# EAGLE design Solenoid Boardv2 (EAGLE 9.1.3)
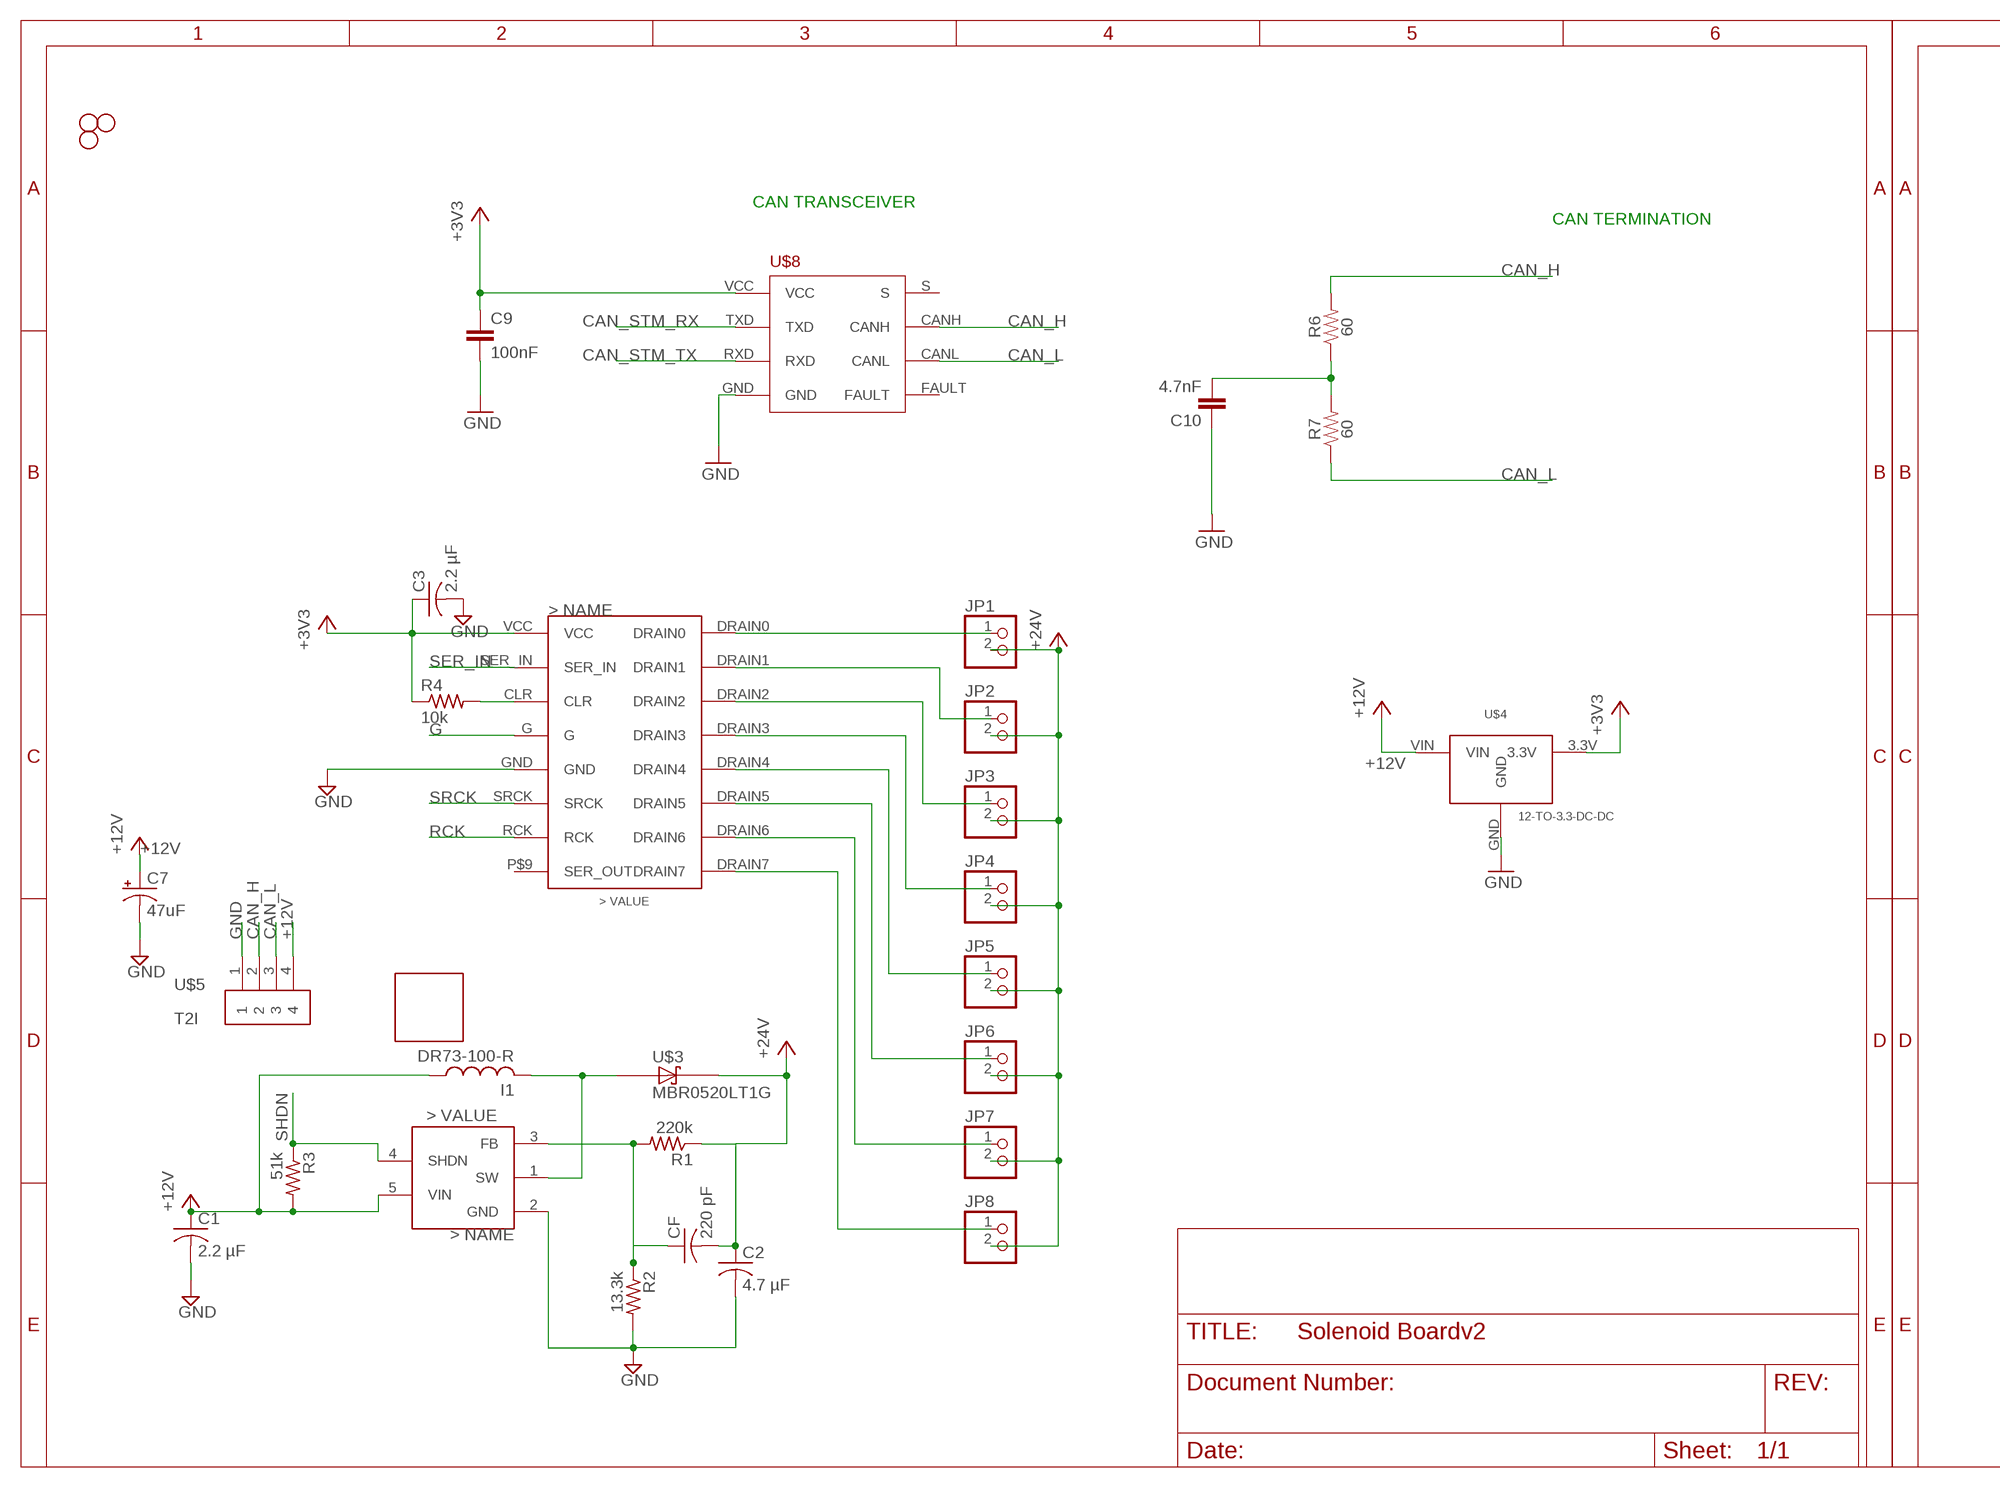
[diagram p0: schematic, sheet 1, part 1 of 2]
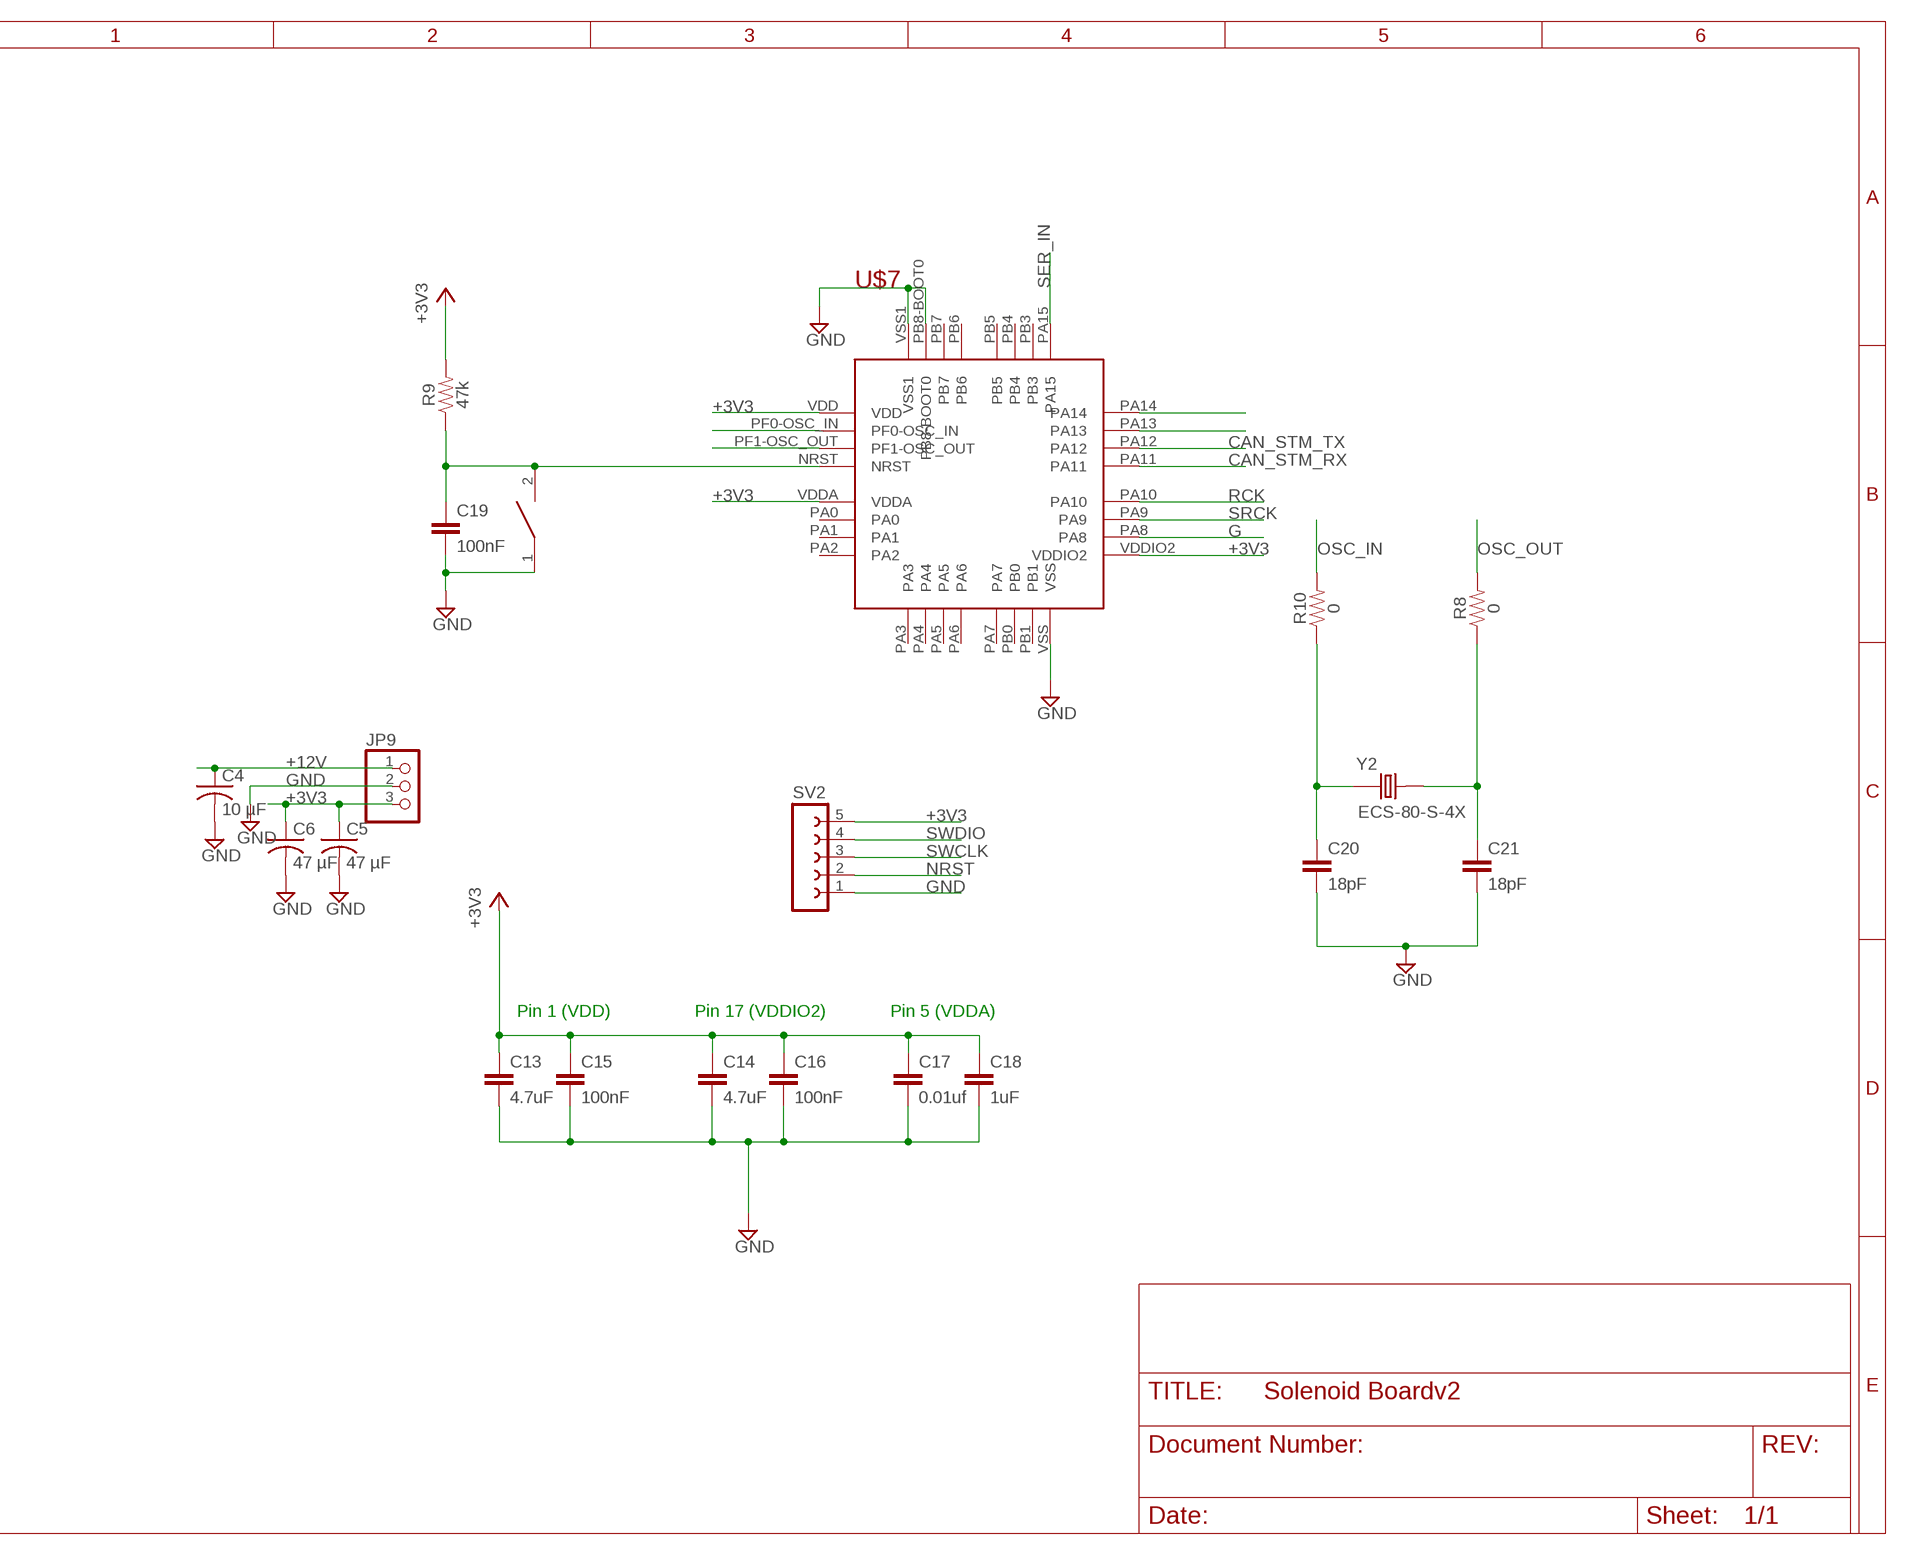
[diagram p1: schematic, sheet 1, part 2 of 2]

## Parts
C1  2.2 µF  C-USC0805  [C0805]
C2  4.7 µF  C-USC0805  [C0805]
C3  2.2 µF  C-USC0805  [C0805]
C4  10 µF  C-USC0805  [C0805]
C5  47 µF  C-USC0805  [C0805]
C6  47 µF  C-USC0805  [C0805]
C7  47uF  47UF-POLAR-PANASONIC_D-35V-20%  [PANASONIC_D]
C9  100nF  4.7UF0603  [0603]
C10  4.7nF  0.1UF-0603-25V-(+80/-20%)  [0603]
C13  4.7uF  4.7UF0603  [0603]
C14  4.7uF  4.7UF0603  [0603]
C15  100nF  4.7UF0603  [0603]
C16  100nF  4.7UF0603  [0603]
C17  0.01uf  4.7UF0603  [0603]
C18  1uF  4.7UF0603  [0603]
C19  100nF  4.7UF0603  [0603]
C20  18pF  4.7UF0603  [0603]
C21  18pF  4.7UF0603  [0603]
CF  220 pF  C-USC0805  [C0805]
H1  STAND-OFF  [STAND-OFF]
H2  STAND-OFF  [STAND-OFF]
H3  STAND-OFF  [STAND-OFF]
I1  DR73-100-R  [DR73-100-R]
JP1  PINHD-1X2  [1X02]
JP2  PINHD-1X2  [1X02]
JP3  PINHD-1X2  [1X02]
JP4  PINHD-1X2  [1X02]
JP5  PINHD-1X2  [1X02]
JP6  PINHD-1X2  [1X02]
JP7  PINHD-1X2  [1X02]
JP8  PINHD-1X2  [1X02]
JP9  PINHD-1X3  [1X03]
R1  220k  R-US_R0603  [R0603]
R2  13.3k  R-US_R0603  [R0603]
R3  51k  R-US_R0603  [R0603]
R4  10k  R-US_R0603  [R0603]
R6  60  1KOHM-0603-1/10W-1%  [0603]
R7  60  1KOHM-0603-1/10W-1%  [0603]
R8  0  1KOHM-0603-1/10W-1%  [0603]
R9  47k  1KOHM-0603-1/10W-1%  [0603]
R10  0  1KOHM-0603-1/10W-1%  [0603]
RESET1  SWITCH  [SW_2512]
SV2  FE05-1  [FE05-1]
U$1  SHIFT_REGISTER  [SHIFT_REGISTER]
U$2  LM27313  [SOT95P300X145-5]
U$3  MBR0520LT1G  [SOD3716X135]
U$4  12-TO-3.3-DC-DC  [MURATA-DCDC]
U$5  T2I  [T2I]
U$6  BOARDPNE  [PNE]
U$7  STM32F042K6T6  [STM32F042K6T6]
U$8  TCAN337D  [TCAN337D]
Y2  ECS-80-S-4X  [XTAL_ECS-80-S-4X]

## Nets
+3V3: C3.1 C5.1 C6.1 C9.1 C13.1 C14.1 C15.1 C16.1 C17.1 C18.1 JP9.3 R4.1 R9.2 SV2.5 U$1.VCC U$4.3.3V U$7.VDD U$7.VDDA U$7.VDDIO2 U$8.VCC
+12V: C1.1 C4.1 C7.+ I1.1 JP9.1 R3.2 U$2.5(VIN) U$4.VIN U$5.4
+24V: C2.1 CF.2 JP1.2 JP2.2 JP3.2 JP4.2 JP5.2 JP6.2 JP7.2 JP8.2 R1.1 U$3.2(C)
CAN_H: R6.2 U$5.2 U$8.CANH
CAN_L: R7.1 U$5.3 U$8.CANL
CAN_STM_RX: U$7.PA11 U$8.TXD
CAN_STM_TX: U$7.PA12 U$8.RXD
CLR: R4.2 U$1.CLR
DRAIN0: JP1.1 U$1.DRAIN0
DRAIN1: JP2.1 U$1.DRAIN1
DRAIN2: JP3.1 U$1.DRAIN2
DRAIN3: JP4.1 U$1.DRAIN3
DRAIN4: JP5.1 U$1.DRAIN4
DRAIN5: JP6.1 U$1.DRAIN5
DRAIN6: JP7.1 U$1.DRAIN6
DRAIN7: JP8.1 U$1.DRAIN7
FB: CF.1 R1.2 R2.1 U$2.3(FB)
G: U$1.G U$7.PA8
GND: C1.2 C2.2 C3.2 C4.2 C5.2 C6.2 C7.- C9.2 C10.1 C13.2 C14.2 C15.2 C16.2 C17.2 C18.2 C19.2 C20.2 C21.2 JP9.2 R2.2 RESET1.1 SV2.1 U$1.GND U$2.2(GND) U$4.GND U$5.1 U$7.PB8-BOOT0 U$7.VSS U$7.VSS1 U$8.GND
N$3: C21.1 R8.1 Y2.2
N$4: C20.1 R10.1 Y2.1
N$5: C10.2 R6.1 R7.2
NRST: C19.1 R9.1 RESET1.2 SV2.2 U$7.NRST
OSC_IN: R10.2 U$7.PF0-OSC_IN
OSC_OUT: R8.2 U$7.PF1-OSC_OUT
RCK: U$1.RCK U$7.PA10
SER_IN: U$1.SER_IN U$7.PA15
SHDN: R3.1 U$2.4(SHDN)
SRCK: U$1.SRCK U$7.PA9
SW: I1.2 U$2.1(SW) U$3.1(A)
SWCLK: SV2.3 U$7.PA14
SWDIO: SV2.4 U$7.PA13
Unconnected: U$1.P$9(SER_OUT) U$7.PA0 U$7.PA1 U$7.PA2 U$7.PA3 U$7.PA4 U$7.PA5 U$7.PA6 U$7.PA7 U$7.PB0 U$7.PB1 U$7.PB3 U$7.PB4 U$7.PB5 U$7.PB6 U$7.PB7 U$8.FAULT U$8.S

## Notes on the sheet
- CAN TRANSCEIVER
- CAN TERMINATION
- Pin 1 (VDD) | Pin 17 (VDDIO2) | Pin 5 (VDDA)

## Library data of the parts
C1-C6 CF = rcl:C-US: CAPACITOR, American symbol; SPICEPREFIX: C
C7 = SparkFun-Capacitors:47UF-POLAR: 47µF polarized capacitors A capacitor is a passive two-terminal electrical component used to store electrical energy temporarily in an electric field.; PROD_ID: CAP-08478
C9 C15-C21 = SparkFun-Capacitors:4.7UF: 4.7µF ceramic capacitors A capacitor is a passive two-terminal electrical component used to store electrical energy temporarily in an electric field.; PROD_ID: CAP-08280; VALUE: 4.7uF
C10 = SparkFun-Capacitors:0.1UF: 0.1µF ceramic capacitors A capacitor is a passive two-terminal electrical component used to store electrical energy temporarily in an electric field.; PROD_ID: CAP-00810; VALUE: 0.1uF
C13 C14 = SparkFun-Capacitors:4.7UF: 4.7µF ceramic capacitors A capacitor is a passive two-terminal electrical component used to store electrical energy temporarily in an electric field.; PROD_ID: CAP-08280
H1-H3 = SparkFun-Hardware:STAND-OFF: Stand Off Drill holes for mechanically mounting via screws, standoffs, etc. Note: Use the keepout ring to avoid running the screw head into surrounding components. Variant Overviews STAND-OFF - Mechanical footprint for a #4 phillips button head screw. STAND-OFF-TIGHT - Mechanical footprint for a #4 phillips button head screw, Example SparkFun Products Screw - Phillips Head (1/4", 4-40, 10 pack) <https://www.sparkfun.com/products/10453> (PRT-10453) Screw - Phillips Head (1/2", 4-40, 10 pack) <https://www.sparkfun.com/products/10452> (PRT-10452) Screw - Phillips Head (3/4", 4-40, 10 pack) <https://www.sparkfun.com/products/10451> (PRT-10451) Screw - Phillips Head (1", 4-40, 10 pack) <https://www.sparkfun.com/products/10450> (PRT-10450)
I1 = Solenoid_parts:DR73-100-R
JP1-JP8 = pinhead:PINHD-1X2: PIN HEADER
JP9 = pinhead:PINHD-1X3: PIN HEADER
R1-R4 = rcl:R-US_: RESISTOR, American symbol; SPICEPREFIX: R
R6-R10 = SparkFun-Resistors:1KOHM: 1kΩ resistor A resistor is a passive two-terminal electrical component that implements electrical resistance as a circuit element. Resistors act to reduce current flow, and, at the same time, act to lower voltage levels within circuits. - Wikipedia; PROD_ID: RES-07856; VALUE: 1k
RESET1 = DiscreteComponents:SWITCH
SV2 = con-lsta:FE05-1: FEMALE HEADER; OC_FARNELL: unknown; OC_NEWARK: unknown
U$1 = Solenoid_parts:SHIFT_REGISTER
U$2 = Solenoid_parts:LM27313
U$3 = Solenoid_parts:MBR0520LT1G: Surface Mount Schottky Power Rectifier Plastic SOD−123 Package
U$4 = minirov:12-TO-3.3-DC-DC: 811-3014-ND
U$5 = BackplaneParts:T2I
U$6 = board_outlines:BOARD
U$7 = PI_Shield_Library:STM32F042K6T6
U$8 = PI_Shield_Library:TCAN337D
Y2 = ECS-80-S-4X:ECS-80-S-4X: CRYSTAL T/H; DESCRIPTION: Crystal 8MHz Series 2-Pin HC-49/U; DIGI-KEY_PART_NUMBER: X1057-ND; DIGI-KEY_PURCHASE_URL: https://www.digikey.com/product-detail/en/ecs-inc/ECS-80-S-4X/X1057-ND/827549?utm_source=snapeda&utm_medium=aggregator&utm_campaign=symbol; MF: ECS International; MP: ECS-80-S-4X; PACKAGE: HC-49/US ECS International

## Board
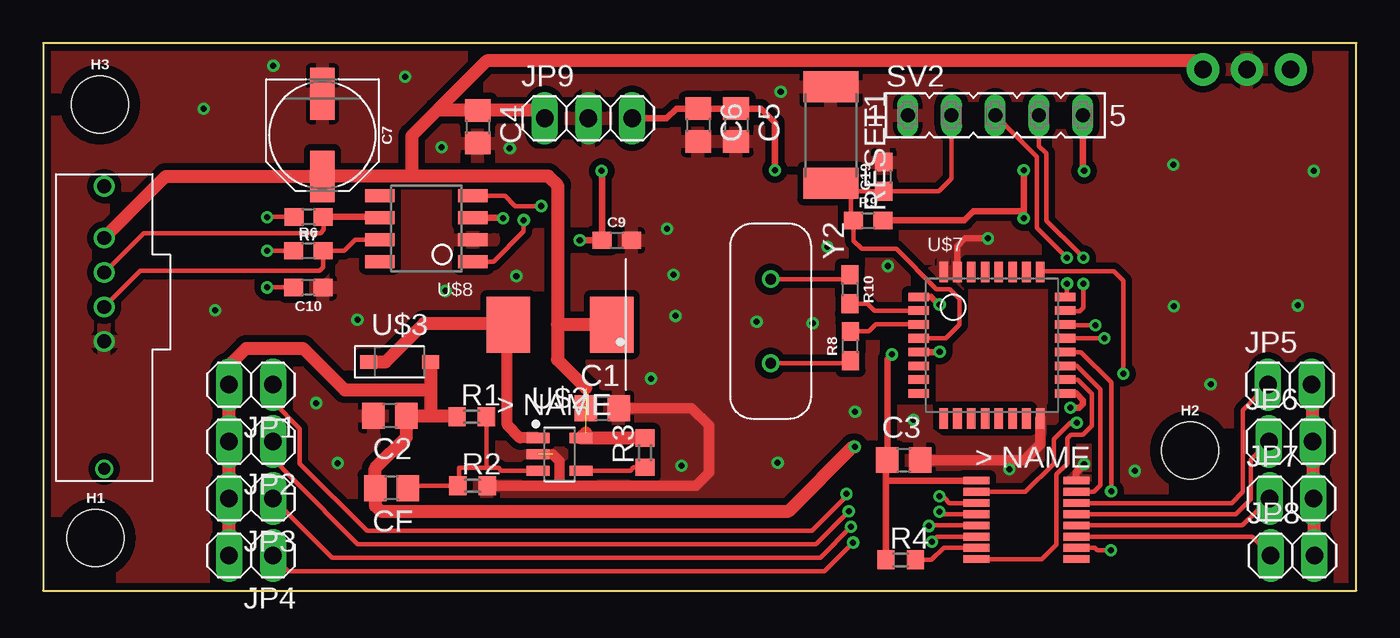
[diagram p2: board, top side]
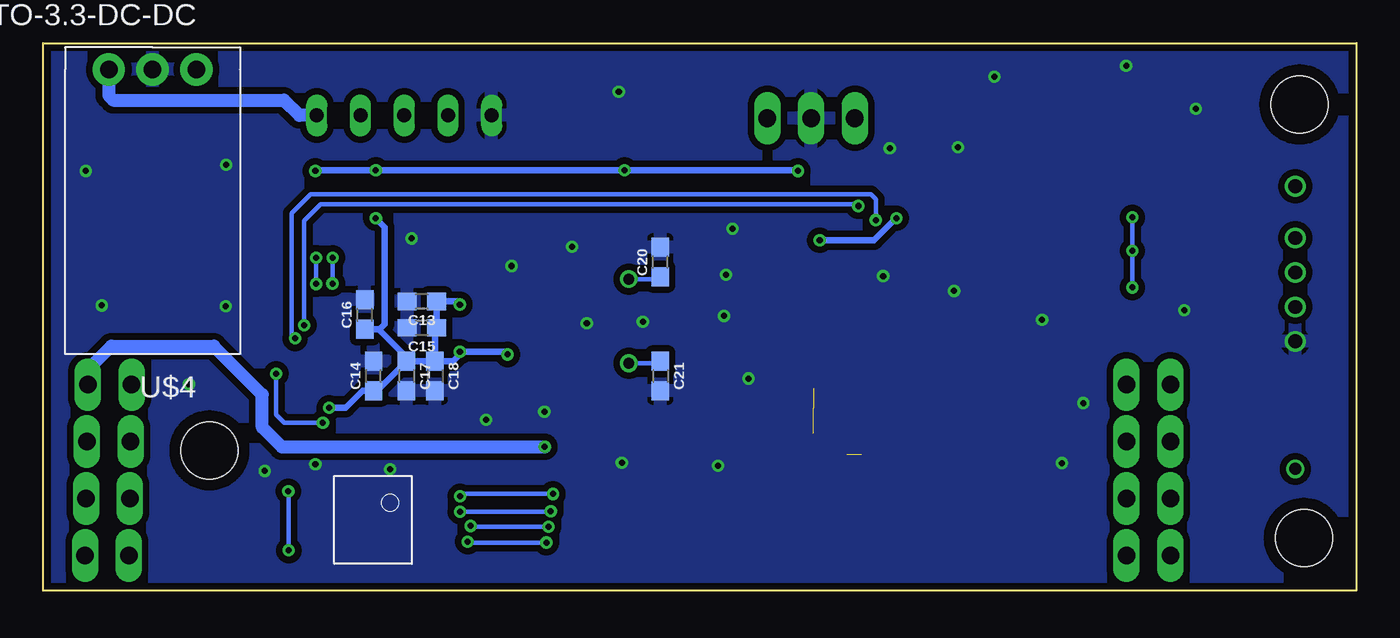
[diagram p3: board, bottom side, seen from below]

Size 76.2 x 31.75 mm. Coordinates in mm from the lower left corner, seen from the top.
Copper layers (1*16): Top 0.0356mm / dielectric 1.5011mm / Bottom 0.0356mm
Design rules "ECE_Senior_Design": minimum track width 8mil, minimum drill 13mil, track to track 8mil, track to pad 8mil, pad to pad 6mil, via to via 8mil, smd to smd 6mil, copper to edge 15mil, drill to drill 8mil, minimum pad ring 7mil, minimum via ring 7mil, stop-mask expansion 3mil, vias tented up to drill 0mil, thermal gap 10mil

### Footprints (pad centres in the part's own frame; a part is rotated, then mirrored left to right if it is on the bottom)
C0805 = smd 1.3 x 1.5: 1 -0.95,0; 2 0.95,0
PANASONIC_D = smd 3 x 1.4: + 2.4,0; - -2.4,0
0603 = smd 1.1 x 1: 1 -0.85,0; 2 0.85,0
STAND-OFF = hole 3.302: 0,0
DR73-100-R = smd 2.5 x 3.25: 1 -3,0; 2 3,0
1X02 = drill 1.016 long: 1 -1.27,0; 2 1.27,0
1X03 = drill 1.016 long: 1 -2.54,0; 2 0,0; 3 2.54,0
R0603 = smd 1 x 1.1: 1 -0.85,0; 2 0.85,0
SW_2512 = smd 1.8 x 3.2: 1 -2.8,0; 2 2.8,0
FE05-1 = drill 0.813 long: 1 -5.08,0; 2 -2.54,0; 3 0,0; 4 2.54,0; 5 5.08,0
SHIFT_REGISTER = smd 1.5 x 0.45: CLR -2.9,-1.625; DRAIN0 -2.9,0.975; DRAIN1 -2.9,0.325; DRAIN2 -2.9,-0.325; DRAIN3 -2.9,-0.975; DRAIN4 2.9,0.975; DRAIN5 2.9,0.325; DRAIN6 2.9,-0.325; DRAIN7 2.9,-0.975; G -2.9,-2.275; GND 2.9,2.275; P$9 2.9,-2.275; RCK 2.9,-1.625; SER_IN -2.9,1.625; SRCK 2.9,1.625; VCC -2.9,2.275
SOT95P300X145-5 = smd 1.319 x 0.589: 1 -1.246,0.95; 2 -1.246,0; 3 -1.246,-0.95; 4 1.246,-0.95; 5 1.246,0.95
SOD3716X135 = smd 0.977 x 0.789: 1 -1.796,0; 2 1.796,0
MURATA-DCDC = drill 1.016 pad 1.88: 3.3V 2.54,0; GND 0,0; VIN -2.54,0
T2I = drill 0.8: 1 8.1,2.8; 2 10.1,2.8; 3 12.1,2.8; 4 14.1,2.8; S2 17.1,2.8 | drill 0.7: S1 0.7,2.8
STM32F042K6T6 = smd 1.2 x 0.5: NRST 0,3.2; PA0 0,1.6; PA1 0,0.8; PA2 0,0; PA8 8.5,0.8; PA9 8.5,1.6; PA10 8.5,2.4; PA11 8.5,3.2; PA12 8.5,4; PA13 8.5,4.8; PA14 8.5,5.6; PF0-OSC_IN 0,4.8; PF1-OSC_OUT 0,4; VDD 0,5.6; VDDA 0,2.4; VDDIO2 8.5,0 | smd 0.5 x 1.2: PA3 1.45,-1.45; PA4 2.25,-1.45; PA5 3.05,-1.45; PA6 3.85,-1.45; PA7 4.65,-1.45; PA15 7.05,7.05; PB0 5.45,-1.45; PB1 6.25,-1.45; PB3 6.25,7.05; PB4 5.45,7.05; PB5 4.65,7.05; PB6 3.85,7.05; PB7 3.05,7.05; PB8-BOOT0 2.25,7.05; VSS 7.05,-1.45; VSS1 1.45,7.05
TCAN337D = smd 1.7 x 0.75: CANH 5.4,2.54; CANL 5.4,1.27; FAULT 5.4,0; GND 0,2.54; RXD 0,0; S 5.4,3.81; TXD 0,3.81; VCC 0,1.27
XTAL_ECS-80-S-4X = drill 0.63 pad 1.03: 1 -2.44,0; 2 2.44,0

### Placement (x,y rotation side)
C1  32.44,10.58 0 top
C2  20.12,10.14 180 top
C3  49.93,7.57 0 top
C4  25.22,26.9 270 top
C5  40.21,27 270 top
C6  38.01,27 270 top
C7  16.21,26.42 270 top
C9  33.28,20.31 0 top
C10  15.4,17.58 180 top
C13  54.23,16.76 180 bottom
C14  57.02,12.45 90 bottom
C15  54.23,15.24 180 bottom
C16  57.53,16 90 bottom
C17  55.12,12.45 270 bottom
C18  53.47,12.45 270 bottom
C19  48.77,24 90 top
C20  40.39,19.05 90 bottom
C21  40.39,12.45 270 bottom
CF  20.22,5.94 180 top
H1  3.05,3.05 0 top
H2  66.55,8.13 0 top
H3  3.3,28.19 0 top
I1  30,15.42 180 top
JP1  12.06,11.94 180 top
JP2  12.06,8.64 180 top
JP3  12.06,5.33 180 top
JP4  12.06,2.03 180 top
JP5  72.34,11.94 0 top
JP6  72.39,8.64 0 top
JP7  72.44,5.33 0 top
JP8  72.49,2.03 0 top
JP9  31.64,27.39 0 top
R1  24.87,10.08 0 top
R2  24.92,6.08 0 top
R3  34.92,7.99 90 top
R4  49.76,1.77 0 top
R6  15.39,19.71 0 top
R7  15.41,21.67 180 top
R8  46.84,14.17 90 top
R9  47.88,21.46 0 top
R10  46.81,17.48 270 top
RESET1  45.72,26.42 270 top
SV2  55.24,27.56 0 top
U$1  57.06,4.1 0 top
U$2  29.97,7.9 0 top
U$3  20.68,13.26 0 top
U$4  69.85,30.23 180 bottom
U$5  6.35,6.35 90 top
U$6  0,0 0 top
U$7  50.8,11.43 0 top
U$8  24.94,22.89 180 top
Y2  42.21,15.62 270 top

### Tracks (layer width: path | path; a pad name or v marks a point on that pad's centre or on a via)
+3V3  (via drill 0.35)
  Top 0.381: U$7.VDDA 52.01,13.83 v52.02,13.84 | v56.9,21.59 56.9,22 | 56.9,22 v56.9,24.38 | U$7.VDDIO2 59.94,11.43 60.33,11.05 60.33,10.79 60.13,10.6 v59.6,10.6 | SV2.5 60.33,24.41 v60.4,24.33 | R9.2 53.45,21.46 53.99,22 56.9,22 | JP9.3 36.18,27.39 36.74,27.95 C6.1 C5.1 41.65,27.95 42.47,27.13 v42.47,24.38 | v32.41,24.33 32.43,24.31 C9.1 31.15,20.31 v31.14,20.32 | v26.7,21.59 26.67,21.62 U$8.VCC | R4.1 48.91,6.35 | 48.91,6.35 48.91,7.5 C3.1 48.98,13.42 v49.25,13.69 | U$1.VCC 48.94,6.38 48.91,6.35 | U$7.VDD 51.52,17.03 51.97,16.59 v52.02,16.59
  Bottom 0.381: C18.1 C17.1 | C17.1 56.82,11.6 C14.1 57.66,11.6 58.65,10.6 v59.6,10.6 | C18.1 53.47,15.15 C15.1 C13.1 52.2,16.76 v52.02,16.59 | v56.9,21.59 56.39,21.08 56.39,15.43 56.67,15.15 C16.1 56.74,15.15 55.12,13.53 C17.1 | v60.4,24.33 60.35,24.38 v56.9,24.38 v42.47,24.38 32.46,24.38 v32.41,24.33 | v26.7,21.59 26.73,21.59 28,20.32 v31.14,20.32 | v49.25,13.69 49.4,13.84 v52.02,13.84 51.88,13.84 52.43,13.3 C18.1
  Bottom 0.762: SV2.5 61.34,27.56 62.23,28.45 72.14,28.45 72.39,28.7 U$4.3.3V
+12V  (2 unrouted)
  Top 0.762: U$5.4 7.12,24.02 C7.+ 19.05,24.03 20.57,24.03 21.39,24.03 | JP9.1 28.64,27.85 C4.1 22.87,27.85 | 21.39,24.03 22.05,24.03 29.31,24.03 29.87,23.47 29.85,23.45 29.85,15.42 | 22.87,27.85 25.74,30.72 66.81,30.72 U$4.VIN | R3.2 32.05,8.84 32.04,8.85 U$2.5 31.49,9.13 | I1.1 29.85,15.42 | 29.85,15.42 29.85,13.39 31.49,11.74 | 22.87,27.85 21.39,26.36 21.39,24.03
+24V  (via drill 0.35)
  Top 0.762: 22.61,10.14 C2.1 21.08,10.13 21.08,8.89 19.27,7.08 CF.2 19.27,4.91 19.57,4.61 43.27,4.61 46.99,8.33 v47.09,8.33 | 22.61,10.14 23.96,10.14 R1.1 | U$3.2 22.48,11.68 | 22.48,11.68 22.48,10.27 22.61,10.14 | JP8.2 73.76,5.31 JP7.2 73.71,8.56 JP6.2 73.66,11.81 JP5.2 | JP4.2 JP3.2 JP2.2 JP1.2 10.79,13.06 11.79,14.05 15.09,14.05 17.5,11.63 22.43,11.63 22.48,11.68
  Bottom 0.762: v47.09,8.33 62.35,8.33 63.49,9.47 63.49,11.37 66.29,14.17 72.24,14.17 73.61,12.8 JP5.2
CAN_H
  Top 0.254: U$8.CANH 18.11,20.35 17.47,19.71 R6.2 16.26,19.69 16.26,18.75 16.05,18.54 5.64,18.54 U$5.2
CAN_L
  Top 0.254: R7.1 16.29,21.64 16.29,20.91 16.1,20.73 5.84,20.73 3.57,18.45 U$5.3 | 19.52,21.64 U$8.CANL
  Top 0.381: R7.1 19.49,21.67 19.52,21.64
CAN_STM_RX  (via drill 0.35)
  Top 0.254: v61.58,14.62 v61.57,14.63 U$7.PA11 | v27.89,21.49 27.89,20.83 26.14,19.08 U$8.TXD
  Bottom 0.254: v61.58,14.62 61.77,14.82 61.77,21.89 60.68,22.98 28.16,22.98 27.89,22.71 v27.89,21.49
CAN_STM_TX  (via drill 0.35)
  Top 0.254: U$8.RXD 26.79,22.89 27.38,22.3 v28.91,22.3 | v61.06,15.39 59.34,15.39 U$7.PA12
  Bottom 0.254: v28.91,22.3 29.01,22.4 60.1,22.4 61.06,21.44 v61.06,15.39
CLR
  Top 0.254: U$1.CLR 52.26,2.48 51.56,1.77 R4.2
DRAIN0  (via drill 0.35)
  Top 0.254: v52,5.47 52.1,5.37 52.28,5.37 52.58,5.08 U$1.DRAIN0 | v46.62,5.6 46.62,5.47 44.61,3.46 18.79,3.46 14.88,7.37 14.88,9.39 13.34,10.94 JP1.1
  Bottom 0.254: v46.62,5.6 51.87,5.6 v52,5.47
DRAIN1  (via drill 0.35)
  Top 0.254: U$1.DRAIN1 52.14,4.42 v52,4.56 | v46.75,4.6 44.84,2.69 18.26,2.69 14.43,6.53 14.43,6.55 13.34,7.64 JP2.1
  Bottom 0.254: v52,4.56 46.78,4.56 v46.75,4.6
DRAIN2  (via drill 0.35)
  Top 0.254: U$1.DRAIN2 51.43,3.77 v51.4,3.75 | v46.87,3.69 45.09,1.91 16.76,1.91 JP3.1
  Bottom 0.254: v46.87,3.69 51.34,3.69 v51.4,3.75
DRAIN3  (via drill 0.35)
  Top 0.254: U$1.DRAIN3 51.85,3.12 v51.56,2.84 | JP4.1 13.34,2.01 14.22,1.12 45.34,1.12 v47,2.78
  Bottom 0.254: v47,2.78 51.51,2.78 v51.56,2.84
DRAIN4
  Top 0.254: U$1.DRAIN4 68.96,5.08 69.62,5.74 69.62,10.46 71.07,11.91 JP5.1
DRAIN5
  Top 0.254: U$1.DRAIN5 69.19,4.42 70.08,5.31 70.08,7.59 JP6.1
DRAIN6
  Top 0.254: U$1.DRAIN6 69.58,3.77 JP7.1
DRAIN7
  Top 0.254: U$1.DRAIN7 70.16,3.12 JP8.1
FB
  Top 0.254: U$2.3 26.58,6.95 26.42,7.11 25.65,7.11 | 25.65,7.11 24.13,7.11 24.13,6.14 R2.1 21.31,6.08 CF.1 | R1.2 25.72,7.18 25.65,7.11
G
  Top 0.254: U$7.PA8 60.03,12.23 60.85,11.42 60.85,9.55 60.34,9.04 59.64,9.04 59.44,8.84 59.44,7.37 58.8,6.73 58.8,2.67 57.96,1.82 U$1.G
GND  (via drill 0.35)  (1 unrouted)
  Top 0.381: U$7.PB8-BOOT0 53.05,19.98 53.49,20.42 v54.81,20.42
  Top 0.406: U$1.GND 59.96,6.87
  Top 0.457: 59.96,6.87 v60.4,7.32
  Top 0.61: U$7.VSS 57.85,8.49 56.92,7.57 C3.2 | 29.57,7.9 29.97,7.49 29.97,6.08 | R2.2 29.6,6.08 29.97,6.08 | C1.2 37.63,10.58 38.63,9.58 38.63,6.83 37.88,6.08 29.97,6.08
  other vias: 9.98,16.26 18.24,15.7 23.34,17.37 37.03,7.24 42.62,7.42 47.12,10.36 50.5,9.91 15.85,10.87 17.09,7.39 23.11,25.7 27.08,25.65 65.61,16.48 67.74,11.96 63.35,6.93 72.8,16.54 73.74,24.33 65.58,24.69 42.8,28.93 49.02,18.82 36.2,20.98 36.58,18.31 36.7,15.93 41.4,15.6 44.65,15.49 45.52,19.94 27.46,18.24 56.06,7.04 13.36,30.43 9.32,27.94 21.01,29.79 35.28,12.29
  pour Top (isolate 0.381): 0.6,31.2 75.7,31.2 75.8,31.1 75.8,0.5 0.6,0.5 0.5,0.6 0.5,31.1
  pour Bottom (isolate 0.381): 0.25,31.5 76.2,31.5 76.2,0.51 0.25,0.51
  pour Top: 28.65,25.55 29.62,25.55 29.62,24.87 27.94,24.87 27.94,25.55
  pour Top: 51.51,9.37 52.35,8.76 51.89,8.33 51.16,8.92 51.49,9.35
N$3
  Top 0.254: Y2.2 46.7,13.18 R8.1
  Bottom 0.254: Y2.2 40.51,13.17 C21.1
N$4
  Top 0.254: Y2.1 46.55,18.06 R10.1
  Bottom 0.254: C20.1 40.52,18.06 Y2.1
N$5  (via drill 0.35)
  Top 0.254: R7.2 13.04,21.67 v13.01,21.64 | v13.01,19.71 R6.1 | v13.01,17.58 C10.2
  Bottom 0.254: v13.01,21.64 v13.01,19.71 v13.01,17.58
NRST
  Top 0.254: RESET1.2 46.18,23.15 46.86,23.15 | 46.86,23.15 C19.1 51.98,23.15 52.7,23.88 SV2.2 | 46.86,23.15 46.86,21.63 R9.1 47.03,20.28 47.5,19.81 49.51,19.81 51.84,17.48 52.6,17.48 53.16,16.92 53.16,15.42 52.37,14.63 U$7.NRST
OSC_IN
  Top 0.254: U$7.PF0-OSC_IN 48.23,16.23 47.84,16.62 R10.2
OSC_OUT
  Top 0.254: U$7.PF1-OSC_OUT 48.32,15.43 47.92,15.02 R8.2
RCK  (via drill 0.35)
  Top 0.254: U$1.RCK 61.04,2.48 61.18,2.33 v61.95,2.33 | U$7.PA10 60.21,13.83 61.97,12.07 v61.97,5.76
  Bottom 0.254: v61.95,2.33 61.95,5.74 v61.97,5.76
SER_IN  (via drill 0.35)
  Top 0.254: v59.97,9.73 59.61,9.73 58.65,8.76 58.65,7.37 57.01,5.72 U$1.SER_IN | v62.68,12.57 62.68,17.97 62.14,18.5 57.88,18.5 U$7.PA15
  Bottom 0.254: v59.97,9.73 62.2,9.73 62.68,10.2 v62.68,12.57
SHDN
  Top 0.254: U$2.4 34.08,6.95 34.27,7.14 R3.1
SRCK
  Top 0.254: U$7.PA9 59.99,13.03 61.34,11.68 61.34,6.1 60.97,5.72 U$1.SRCK
SW
  Top 0.635: U$2.1 27.7,8.85 27.69,8.84 26.92,9.6 26.92,15.49
  Top 0.762: I1.2 26.92,15.49 22.1,15.49 19.86,13.26 U$3.1
SWCLK  (via drill 0.35)
  Top 0.254: SV2.3 57.66,25.15 57.66,21.04 v59.4,19.3 | v59.41,17.8 59.41,17.14 U$7.PA14
  Bottom 0.254: v59.4,19.3 v59.4,17.82 v59.41,17.8
SWDIO  (via drill 0.35)
  Top 0.254: SV2.4 57.78,25.78 58.22,25.35 58.22,21.45 60.08,19.58 60.08,19.57 v60.35,19.3 | v60.35,17.78 60.35,16.41 60.14,16.2 59.33,16.2
  Top 0.381: U$7.PA13 59.33,16.2
  Bottom 0.254: v60.35,19.3 v60.35,17.78